# EAGLE design robotModule (EAGLE 7.3.0)
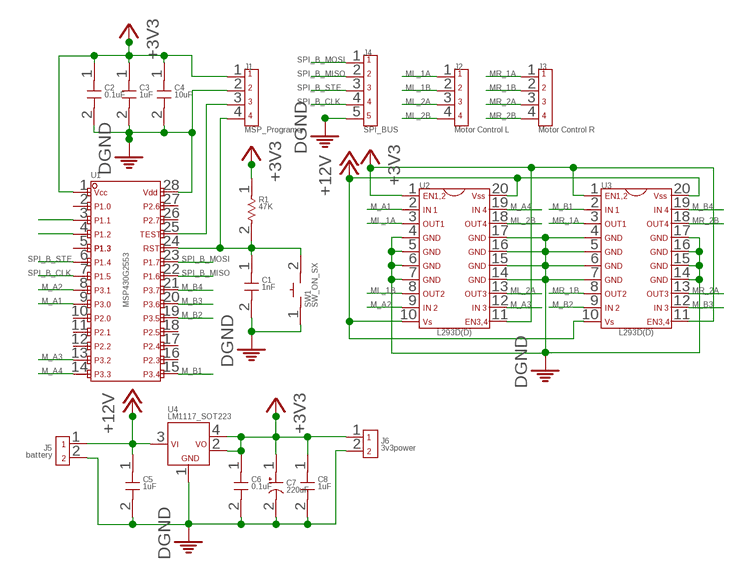
[diagram p0: schematic, sheet 1]

## Parts
C1  1nF  CAPACITOR_FIXED_0805  [0805]
C2  0.1uF  CAPACITOR_FIXED_0805  [0805]
C3  1uF  CAPACITOR_FIXED_0805  [0805]
C4  10uF  CAPACITOR_FIXED_0805  [0805]
C5  1uF  CAPACITOR_FIXED_0805  [0805]
C6  0.1uF  CAPACITOR_FIXED_0805  [0805]
C7  220uF  CAPACITOR_POLARIZED_530_530  [CAP_530_530]
C8  1uF  CAPACITOR_FIXED_0805  [0805]
J1  MSP_Programer  CON_HEADER_4PIN_100  [CON_HEADER_4_100]
J2  Motor Control L  CON_HEADER_4PIN_100  [CON_HEADER_4_100]
J3  Motor Control R  CON_HEADER_4PIN_100  [CON_HEADER_4_100]
J4  SPI_BUS  CON_HEADER_5PIN_100  [CON_HEADER_5_100]
J5  battery  CON_HEADER_2PIN_200  [CON_HEADER_2_200]
J6  3v3power  CON_HEADER_2PIN_100  [CON_HEADER_2_100]
R1  47K  RESISTOR_0805  [0805]
SW1  SW_ON_SX  [SW_S]
U1  MSP430G2553_24IO_28PIN_TSSOP  [TSSOP_28]
U2  L293D(D)_ST_SMD  [SOIC_20]
U3  L293D(D)_ST_SMD  [SOIC_20]
U4  LM1117_SOT223  [SOT_233_4]

## Nets
+3V3: C2.1 C3.1 C4.1 C6.1 C7.1 C8.1 J1.1 J6.1 R1.1 U1.1 U2.1 U2.11 U3.1 U3.11 U4.2 U4.4
+12V: C5.1 J5.1 U2.10 U2.20 U3.10 U3.20 U4.3
DGND: C1.2 C2.2 C3.2 C4.2 C5.2 C6.2 C7.2 C8.2 J1.2 J4.5 J5.2 J6.2 SW1.1 U1.28 U2.4 U2.5 U2.6 U2.7 U2.14 U2.15 U2.16 U2.17 U3.4 U3.5 U3.6 U3.7 U3.14 U3.15 U3.16 U3.17 U4.1
M_A1: U1.9 U2.2
M_A2: U1.8 U2.9
M_A3: U1.13 U2.12
M_A4: U1.14 U2.19
M_B1: U1.15 U3.2
M_B2: U1.19 U3.9
M_B3: U1.20 U3.12
M_B4: U1.21 U3.19
ML_1A: J2.1 U2.3
ML_1B: J2.2 U2.8
ML_2A: J2.3 U2.13
ML_2B: J2.4 U2.18
MR_1A: J3.1 U3.3
MR_1B: J3.2 U3.8
MR_2A: J3.3 U3.13
MR_2B: J3.4 U3.18
MSP430REST: C1.1 J1.4 R1.2 SW1.2 U1.24
N$1: J1.3 U1.25
N$2: U1.3
N$3: U1.4
SPI_B_CLK: J4.4 U1.7
SPI_B_MISO: J4.2 U1.22
SPI_B_MOSI: J4.1 U1.23
SPI_B_STE: J4.3 U1.6
Unconnected: U1.2 U1.5 U1.10 U1.11 U1.12 U1.16 U1.17 U1.18 U1.26 U1.27

## Library data of the parts
C1-C6 C8 = ivani_lib:CAPACITOR_FIXED
C7 = ivani_lib:CAPACITOR_POLARIZED
J1-J3 = ivani_lib:CON_HEADER_4PIN
J4 = ivani_lib:CON_HEADER_5PIN
J5 J6 = ivani_lib:CON_HEADER_2PIN
R1 = ivani_lib:RESISTOR
SW1 = robot_lib:SW_ON
U1 = robot_lib:MSP430G2553_24IO_28PIN
U2 U3 = robot_lib:L293D(D)_ST_SMD
U4 = robot_lib:LM1117

## Board
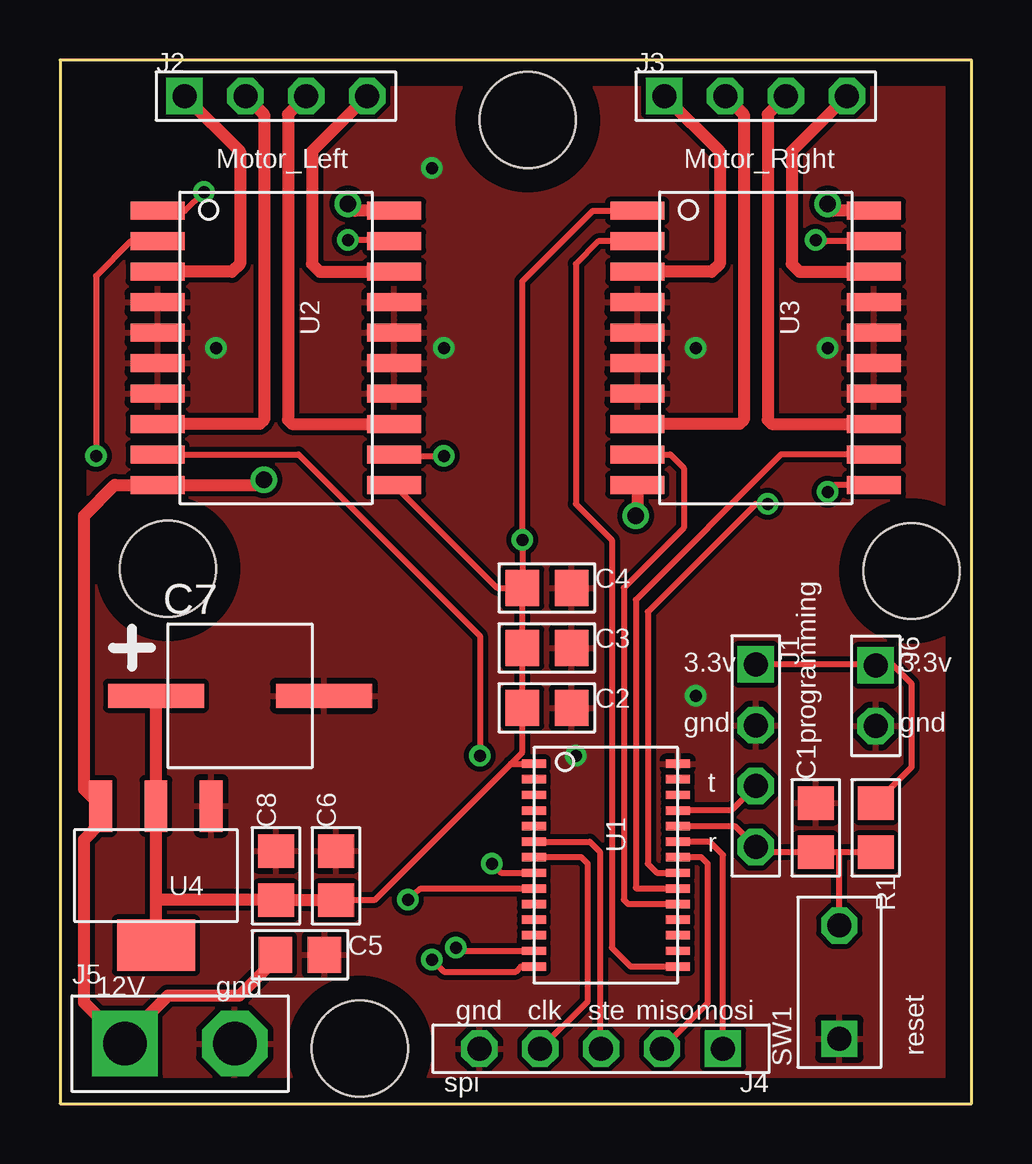
[diagram p1: board, top side]
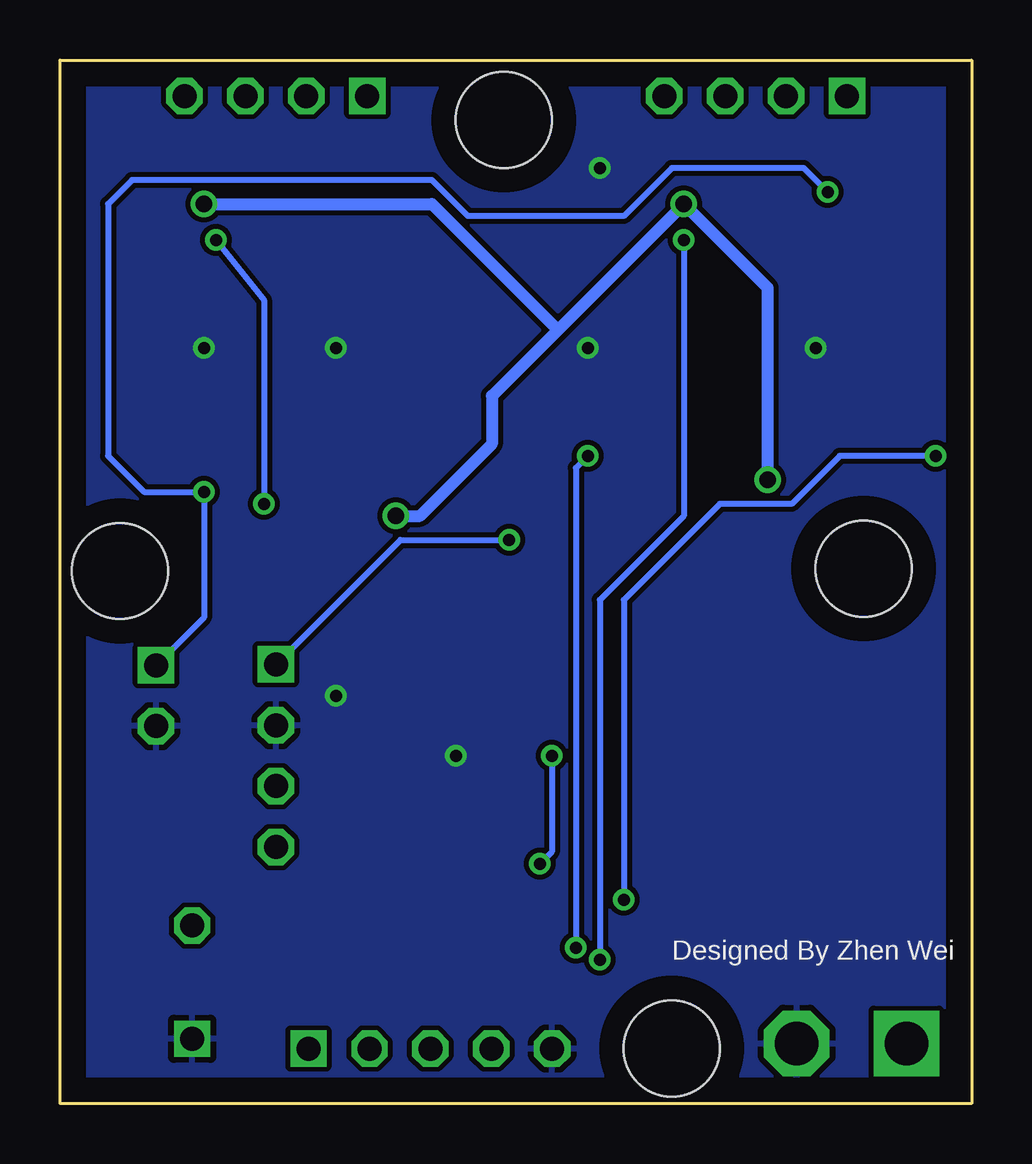
[diagram p2: board, bottom side, seen from below]

Size 38 x 43.5 mm. Coordinates in mm from the lower left corner, seen from the top.
Outline: 0,0 38,0 38,43.5 0,43.5 0,0
Copper layers (1*16): Top 0.035mm / dielectric 1.5mm / Bottom 0.035mm
Design rules "default": minimum track width 10mil, minimum drill 24mil, track to track 8mil, track to pad 8mil, pad to pad 8mil, via to via 8mil, smd to smd 8mil, copper to edge 40mil, drill to drill 8mil, minimum pad ring 10mil, minimum via ring 8mil, stop-mask expansion 4mil, vias tented up to drill 0mil, thermal gap 10mil
Holes 4 mm at 4.5,22.3 35.5,22.2 12.5,2.3 19.5,41

### Footprints (pad centres in the part's own frame; a part is rotated, then mirrored left to right if it is on the bottom)
0805 = smd 1.4 x 1.5: 1 -1.025,0; 2 1.025,0
CAP_530_530 = smd 4 x 1: 1 -3.5,0; 2 3.5,0
CON_HEADER_4_100 = drill 1 square: 1 -3.81,0 | drill 1 octagon: 2 -1.27,0; 3 1.27,0; 4 3.81,0
CON_HEADER_5_100 = drill 1 square: 1 -5.08,0 | drill 1 octagon: 2 -2.54,0; 3 0,0; 4 2.54,0; 5 5.08,0
CON_HEADER_2_200 = drill 1.82 square: 1 -2.29,0 | drill 1.82 octagon: 2 2.29,0
CON_HEADER_2_100 = drill 1 square: 1 -1.27,0 | drill 1 octagon: 2 1.27,0
SW_S = drill 1 square: 1 -2.36,0 | drill 1 octagon: 2 2.36,0
TSSOP_28 = smd 0.35 x 1: 1 -4.225,-3; 2 -3.575,-3; 3 -2.925,-3; 4 -2.275,-3; 5 -1.625,-3; 6 -0.975,-3; 7 -0.325,-3; 8 0.325,-3; 9 0.975,-3; 10 1.625,-3; 11 2.275,-3; 12 2.925,-3; 13 3.575,-3; 14 4.225,-3; 15 4.225,3; 16 3.575,3; 17 2.925,3; 18 2.275,3; 19 1.625,3; 20 0.975,3; 21 0.325,3; 22 -0.325,3; 23 -0.975,3; 24 -1.625,3; 25 -2.275,3; 26 -2.925,3; 27 -3.575,3; 28 -4.225,3
SOIC_20 = smd 0.75 x 2.25: 1 -5.715,-4.935; 2 -4.445,-4.935; 3 -3.175,-4.935; 4 -1.905,-4.935; 5 -0.635,-4.935; 6 0.635,-4.935; 7 1.905,-4.935; 8 3.175,-4.935; 9 4.445,-4.935; 10 5.715,-4.935; 11 5.715,4.935; 12 4.445,4.935; 13 3.175,4.935; 14 1.905,4.935; 15 0.635,4.935; 16 -0.635,4.935; 17 -1.905,4.935; 18 -3.175,4.935; 19 -4.445,4.935; 20 -5.715,4.935
SOT_233_4 = smd 0.95 x 2.15: 1 -2.3,-2.9; 2 0,-2.9; 3 2.3,-2.9 | smd 3.25 x 2.15: 4 0,2.9

### Placement (x,y rotation side)
C1  31.5,11.5 90 top
C2  20.3,16.5 0 top
C3  20.3,19 0 top
C4  20.3,21.5 0 top
C5  10,6.2 0 top
C6  11.5,9.5 90 top
C7  7.5,17 0 top
C8  9,9.5 90 top
J1  29,14.5 270 top
J2  9,42 0 top
J3  29,42 0 top
J4  22.56,2.29 180 top
J5  5,2.5 0 top
J6  34,17 270 top
R1  34,11.5 270 top
SW1  32.49,5.06 90 top
U1  22.75,9.94 270 top
U2  9,31.5 270 top
U3  29,31.5 270 top
U4  4,9.5 180 top

### Tracks (layer width: path | path; a pad name or v marks a point on that pad's centre or on a via)
+3V3  (via drill 0.5)
  Top 0.254: C4.1 C3.1 C2.1 19.27,14.64 18.8,14.16 | 18.8,14.16 U1.1 | 18.8,14.16 13.11,8.47 C6.1 | R1.1 35.5,14.03 35.5,17.5 34.73,18.27 J6.1 33.96,18.31 J1.1 | U3.1 22.21,37.22 19.27,34.27 v19.27,23.5 C4.1 | U2.11 18.22,21.5 C4.1 | U2.1 5.21,37.22 v6,38 | U3.11 32.28,25.79 v32,25.5
  Top 0.508: U4.4 4,8.5 | 4,8.5 U4.2 C7.1 | C6.1 C8.1 8.97,8.5 4,8.5
  Bottom 0.254: J1.1 23.81,23.5 v19.27,23.5 | J6.1 32,20.27 v32,25.5 34.5,25.5 36,27 36,37.5 35,38.5 22.5,38.5 21,37 14.5,37 12.5,39 7,39 v6,38
+12V  (via drill 0.7)
  Top 0.508: U2.20 12.29,37.22 v12,37.5 | U3.10 24.07,24.57 v24,24.5 | U3.20 32.22,37.22 v32,37.5 | v8.5,26 8.29,25.79 U2.10 2.29,25.79 1,24.5 1,13.1 U4.3 1.7,11.7 1,11 1,4.21 J5.1 2.71,2.71 4.5,4.5 7.47,4.5 8.97,6 C5.1
  Bottom 0.508: v24,24.5 23,24.5 20,27.5 20,29.5 17.25,32.25 | 17.25,32.25 v12,37.5 8.5,34 v8.5,26 | v32,37.5 22.5,37.5 17.25,32.25
DGND  (via drill 0.5)
  other vias: 26.5,31.5 32,31.5 6.5,31.5 16,31.5 26.5,17 21.5,14.5 15.5,39
  pour Bottom: 0.5,43 37.5,43 37.5,0.5 0.5,0.5
  pour Top: 0.5,43 37.5,43 37.5,0.5 0.5,0.5
M_A1  (via drill 0.5)
  Top 0.254: U2.2 2.94,35.95 1.5,34.5 v1.5,27 | v14.5,8.5 15.04,8.96 U1.9
  Bottom 0.254: v14.5,8.5 14.5,21 10.5,25 7.5,25 5.5,27 v1.5,27
M_A2  (via drill 0.5)
  Top 0.254: U2.9 9.95,27.05 17.5,19.5 v17.5,14.5 | v18,10 18.39,9.62 U1.8
  Bottom 0.254: v17.5,14.5 17.5,10.5 v18,10
M_A3  (via drill 0.5)
  Top 0.254: U2.12 13.99,27 v16,27 | v16.5,6.5 16.64,6.37 U1.13
  Bottom 0.254: v16,27 16.5,26.5 v16.5,6.5
M_A4  (via drill 0.5)
  Top 0.254: U2.19 13.88,36 v12,36 | v15.5,6 16,5.5 19,5.5 19.21,5.71 U1.14
  Bottom 0.254: v12,36 12,24.5 15.5,21 v15.5,6
M_B1
  Top 0.254: U3.2 22.45,35.95 21.5,35 21.5,25 23,23.5 23,6.5 23.79,5.71 U1.15
M_B2
  Top 0.254: U3.9 25.45,27.05 26,26.5 26,24 23.5,21.5 23.5,8.5 23.68,8.31 U1.19
M_B3
  Top 0.254: U3.12 30.05,27.05 24,21 24,9 24.04,8.96 U1.20
M_B4  (via drill 0.5)
  Top 0.254: U1.21 24.89,9.62 24.5,10 24.5,20.5 29,25 v29.5,25 | U3.19 31.95,35.95 v31.5,36
  Bottom 0.254: v31.5,36 29.5,33.5 v29.5,25
ML_1A
  Top 0.508: J2.1 7.5,39.69 7.5,35 7.17,34.67 U2.3
ML_1B
  Top 0.508: J2.2 8.5,41.23 8.5,28.5 8.32,28.32 U2.8
ML_2A
  Top 0.508: J2.3 9.5,41.23 9.5,28.5 9.68,28.32 U2.13
ML_2B
  Top 0.508: J2.4 10.5,39.69 10.5,35 10.82,34.67 U2.18
MR_1A
  Top 0.508: J3.1 27.5,39.69 27.5,35 27.18,34.67 U3.3
MR_1B
  Top 0.508: J3.2 28.5,41.23 28.5,28.5 28.32,28.32 U3.8
MR_2A
  Top 0.508: J3.3 29.5,41.23 29.5,28.5 29.68,28.32 U3.13
MR_2B
  Top 0.508: J3.4 30.5,39.69 30.5,35 30.82,34.67 U3.18
MSP430REST
  Top 0.254: R1.2 32.5,10.47 | 32.5,10.47 C1.1 29.21,10.47 J1.4 28.12,11.56 U1.24 | SW1.2 32.49,10.46 32.5,10.47
N$1
  Top 0.254: J1.3 27.98,12.21 U1.25
SPI_B_CLK
  Top 0.254: J4.4 22,4.27 22,10 21.73,10.27 U1.7
SPI_B_MISO
  Top 0.254: J4.2 27,4.19 27,10 26.73,10.27 U1.22
SPI_B_MOSI
  Top 0.254: J4.1 27.64,10.36 27.09,10.91 U1.23
SPI_B_STE
  Top 0.254: U1.6 22.09,10.91 22.5,10.5 22.5,2.35 J4.3

### Text on the board
tPlace: Motor_Left | Motor_Right | 3.3v | 3.3v | gnd | gnd | programming | t | r | 12V | gnd | gnd | clk | ste | miso | mosi | reset | spi
bPlace: Designed By Zhen Wei